# EAGLE design ADS1248Shield (EAGLE 7.5.0)
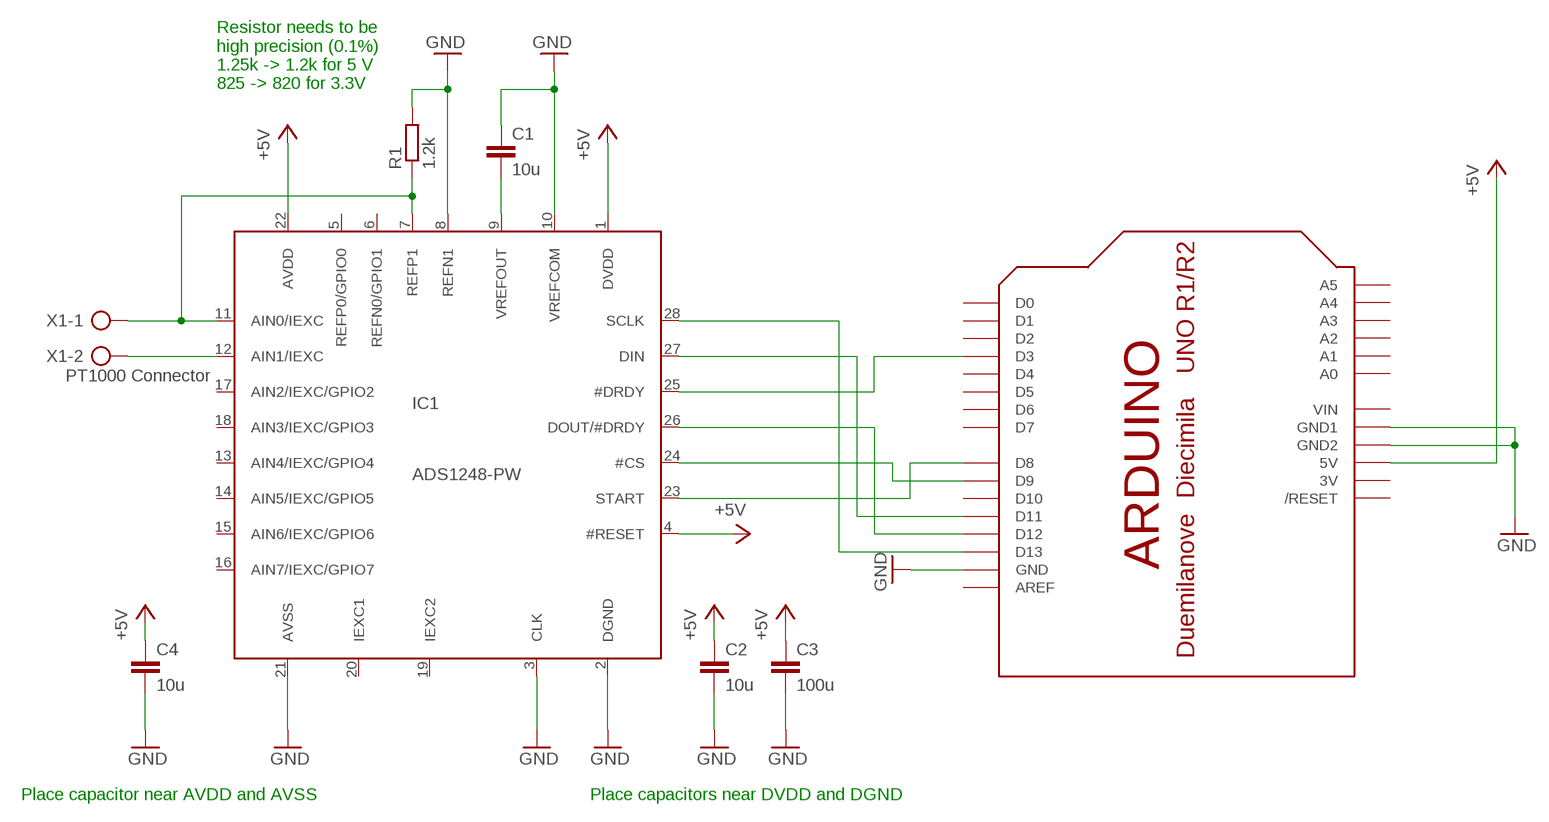
[diagram p0: schematic, sheet 1]

## Parts
C1  10u  C2.5/4  [C2.5-4]
C2  10u  C2.5/4  [C2.5-4]
C3  100u  C2.5/4  [C2.5-4]
C4  10u  C2.5/4  [C2.5-4]
IC1  ADS1248-PW  [TSSOP28]
R1  1.2k  R-EU_0204/2V  [0204V]
U$1  ARDUINOUNO  [ARDUINO]
X1  PT1000 Connector  AK300/2  [AK300/2]

## Nets
+5V: C2.1 C3.1 C4.1 IC1.1(DVDD) IC1.4(#RESET) IC1.22(AVDD) U$1.5V
GND: C1.1 C2.2 C3.2 C4.2 IC1.2(DGND) IC1.3(CLK) IC1.8(REFN1) IC1.10(VREFCOM) IC1.21(AVSS) R1.2 U$1.GND U$1.GND1 U$1.GND2
N$1: IC1.7(REFP1) IC1.11(AIN0/IEXC) R1.1 X1.1
N$2: IC1.28(SCLK) U$1.D13
N$3: IC1.12(AIN1/IEXC) X1.2
N$4: IC1.27(DIN) U$1.D11
N$5: IC1.25(#DRDY) U$1.D3
N$6: IC1.26(DOUT/#DRDY) U$1.D12
N$7: IC1.24(#CS) U$1.D9
N$8: IC1.23(START) U$1.D8
N$9: C1.2 IC1.9(VREFOUT)
Unconnected: IC1.5(REFP0/GPIO0) IC1.6(REFN0/GPIO1) IC1.13(AIN4/IEXC/GPIO4) IC1.14(AIN5/IEXC/GPIO5) IC1.15(AIN6/IEXC/GPIO6) IC1.16(AIN7/IEXC/GPIO7) IC1.17(AIN2/IEXC/GPIO2) IC1.18(AIN3/IEXC/GPIO3) IC1.19(IEXC2) IC1.20(IEXC1) U$1.A0 U$1.A1 U$1.A2 U$1.A3 U$1.A4 U$1.A5 U$1.AREF U$1.D0 U$1.D1 U$1.D2 U$1.D4 U$1.D5 U$1.D6 U$1.D7 U$1.D10 U$1.RESET(/RESET)

## Notes on the sheet
- Resistor needs to be
  high precision (0.1%)
  1.25k -> 1.2k for 5 V
  825 -> 820 for 3.3V
- Place capacitor near AVDD and AVSS | Place capacitors near DVDD and DGND

## Power pins joined to a net without a drawn wire
3V: U$1.3V
VIN: U$1.VIN

## Library data of the parts
C1-C4 = capacitor-wima:C: CAPACITOR naming: grid - package width
IC1 = ADS1248:ADS1248
R1 = resistor:R-EU_: RESISTOR, European symbol
U$1 = adafruit:ARDUINO: Arduino Diecimila/Duemilanove Make a shield with ease, this package has all the named pins as well as the two mounting drill holes and an outline of the USB and DC power connector. The outline is on the DIMENSION layer, so if your board house uses it they will cut the outline to match. http://www.ladyada.net/library/pcb/eaglelibrary.html
X1 = con-ptr500:AK300/2: CONNECTOR; OC_FARNELL: unknown; OC_NEWARK: unknown

## Board
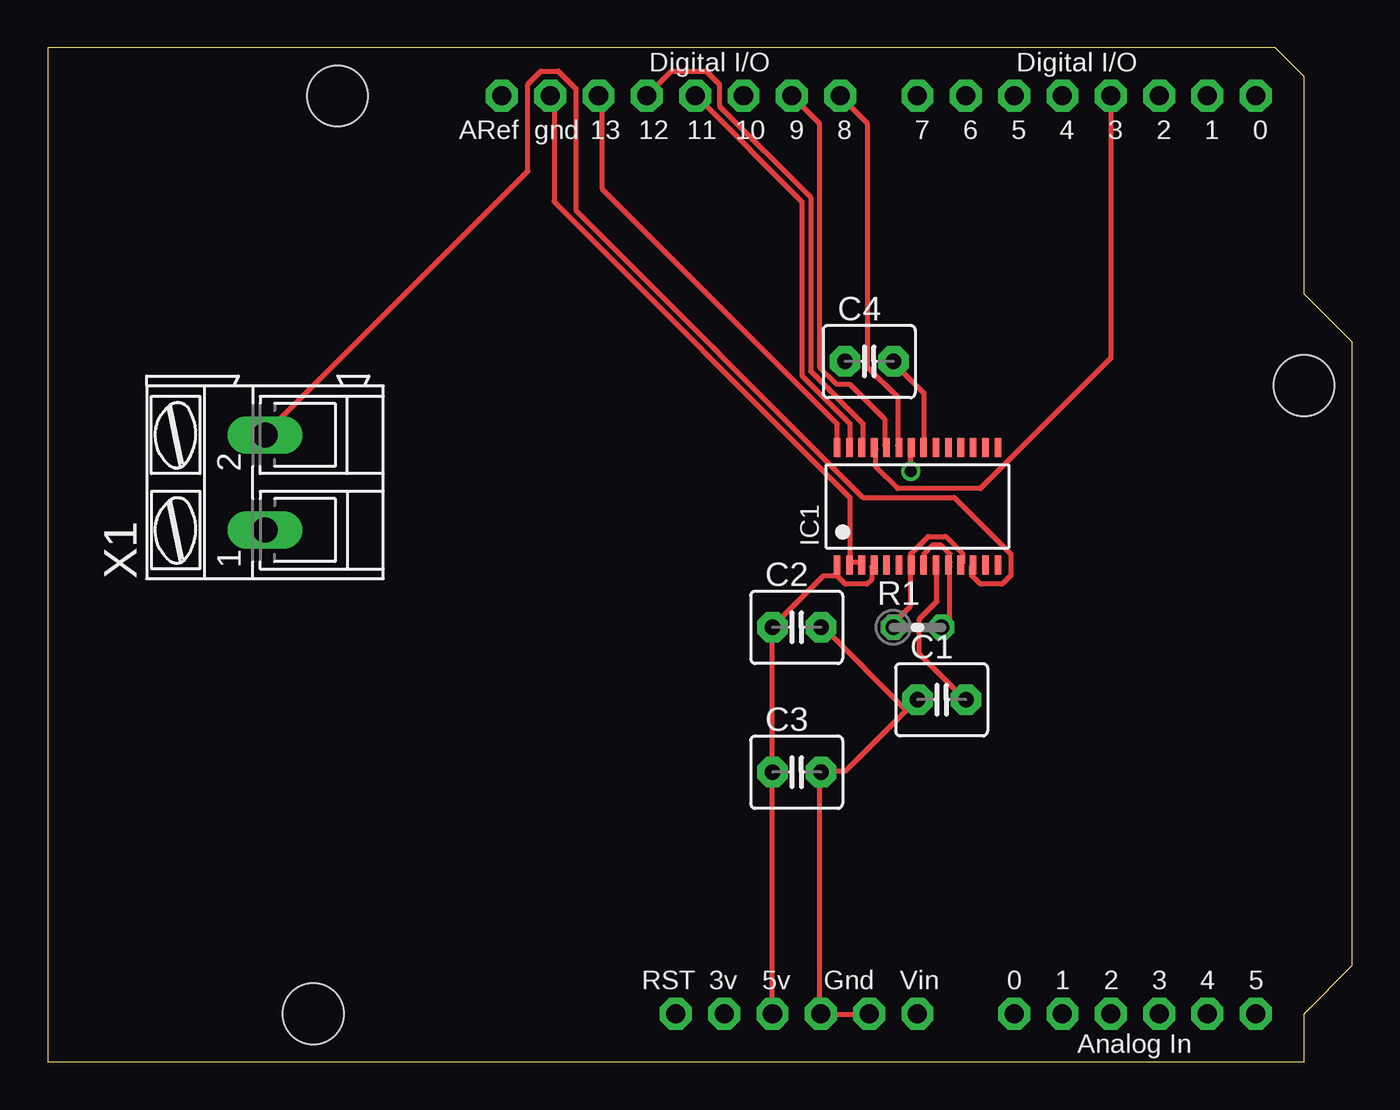
[diagram p1: board, top side]
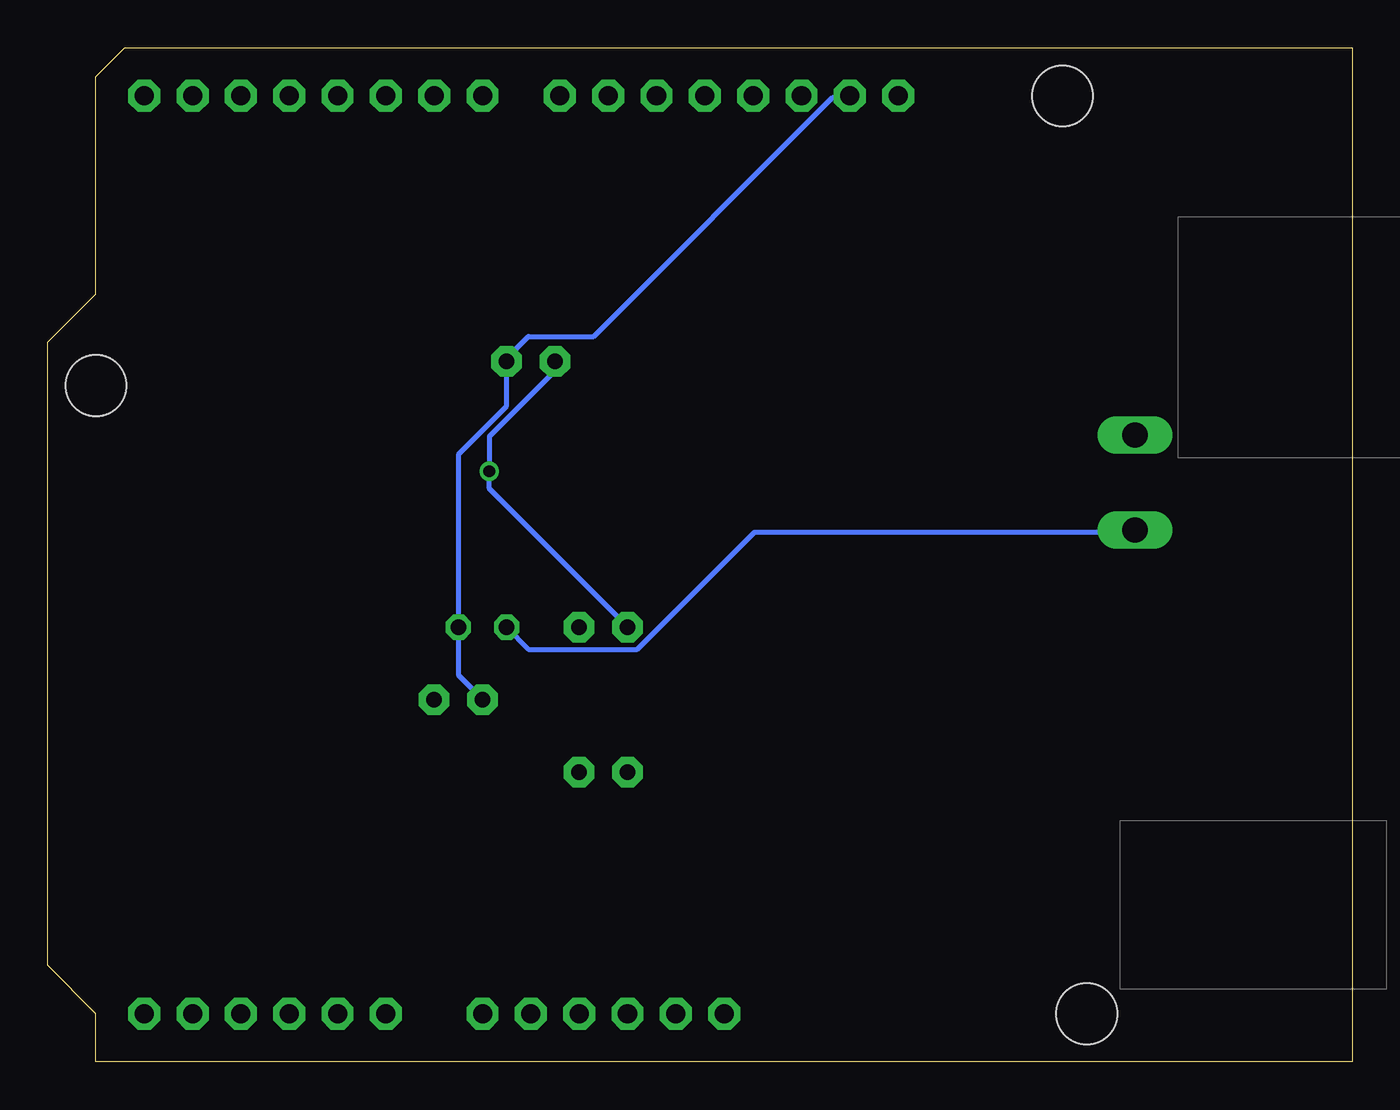
[diagram p2: board, bottom side, seen from below]

Size 68.58 x 53.34 mm. Coordinates in mm from the lower left corner, seen from the top.
Copper layers (1*16): Top 0.035mm / dielectric 1.5mm / Bottom 0.035mm
Design rules "default": minimum track width 10mil, minimum drill 24mil, track to track 8mil, track to pad 8mil, pad to pad 8mil, via to via 8mil, smd to smd 8mil, copper to edge 40mil, drill to drill 8mil, minimum pad ring 10mil, minimum via ring 8mil, stop-mask expansion 4mil, vias tented up to drill 0mil, thermal gap 10mil

### Footprints (pad centres in the part's own frame; a part is rotated, then mirrored left to right if it is on the bottom)
C2.5-4 = drill 0.813 pad 1.6 octagon: 1 -1.27,0; 2 1.27,0
TSSOP28 = smd 0.35 x 1: 1 -4.225,-3.087; 2 -3.575,-3.087; 3 -2.925,-3.087; 4 -2.275,-3.087; 5 -1.625,-3.087; 6 -0.975,-3.087; 7 -0.325,-3.087; 8 0.325,-3.087; 9 0.975,-3.087; 10 1.625,-3.087; 11 2.275,-3.087; 12 2.925,-3.087; 13 3.575,-3.087; 14 4.225,-3.087; 15 4.225,3.087; 16 3.575,3.087; 17 2.925,3.087; 18 2.275,3.087; 19 1.625,3.087; 20 0.975,3.087; 21 0.325,3.087; 22 -0.325,3.087; 23 -0.975,3.087; 24 -1.625,3.087; 25 -2.275,3.087; 26 -2.925,3.087; 27 -3.575,3.087; 28 -4.225,3.087
0204V = drill 0.813 octagon: 1 -1.27,0; 2 1.27,0
ARDUINO = drill 1 pad 1.676 octagon: 3V 35.56,2.54; 5V 38.1,2.54; A0 50.8,2.54; A1 53.34,2.54; A2 55.88,2.54; A3 58.42,2.54; A4 60.96,2.54; A5 63.5,2.54; AREF 23.876,50.8; D0 63.5,50.8; D1 60.96,50.8; D2 58.42,50.8; D3 55.88,50.8; D4 53.34,50.8; D5 50.8,50.8; D6 48.26,50.8; D7 45.72,50.8; D8 41.656,50.8; D9 39.116,50.8; D10 36.576,50.8; D11 34.036,50.8; D12 31.496,50.8; D13 28.956,50.8; GND 26.416,50.8; GND1 43.18,2.54; GND2 40.64,2.54; RESET 33.02,2.54; VIN 45.72,2.54 | hole 3.2: 15.24,50.8; 66.04,35.56; 13.97,2.54
AK300/2 = drill 1.321 long: 1 -2.515,0; 2 2.489,0

### Placement (x,y rotation side)
C1  46.99,19.05 0 top
C2  39.37,22.86 0 top
C3  39.37,15.24 0 top
C4  43.18,36.83 0 top
IC1  45.72,29.21 0 top
R1  45.72,22.86 0 top
U$1  0,0 0 top
X1  11.43,30.48 90 top

### Tracks (layer width: path | path; a pad name or v marks a point on that pad's centre or on a via)
+5V  (via drill 0.61)
  Top 0.254: v45.36,31.06 45.36,32.21 IC1.22 | 41.48,25.58 41.48,26.04 IC1.1 | 41.48,25.58 41.94,25.12 43.08,25.12 43.31,25.35 43.31,26.04 IC1.4 | 41.48,25.58 40.79,25.58 38.28,23.06 C2.1 38.05,22.84 38.05,15.29 C3.1 38.05,15.06 38.05,2.72 U$1.5V
  Bottom 0.254: C4.1 41.94,36.78 41.94,36.32 45.36,32.89 v45.36,31.06 45.36,30.15 38.28,23.06 C2.1
GND
  Top 0.254: 42.16,26.26 42.62,26.26 IC1.3 | 42.16,26.26 42.16,29.69 26.62,45.24 26.62,50.72 U$1.GND | 42.16,26.26 IC1.2 | U$1.GND1 43.08,2.49 40.79,2.49 U$1.GND2 40.56,2.72 40.56,15.06 C3.2 40.79,15.29 41.94,15.29 45.14,18.49 | IC1.21 46.05,32.44 46.05,35.18 44.45,36.78 C4.2 | IC1.8 46.05,26.26 46.05,26.72 46.51,27.18 46.97,27.18 47.42,26.72 47.42,26.26 IC1.10 47.42,26.04 47.42,23.29 R1.2 | 45.14,18.49 45.59,18.95 C1.1 | 45.14,18.49 40.79,22.84 C2.2
  Bottom 0.254: C1.1 45.82,19.18 46.97,20.32 46.97,22.84 R1.2 46.97,23.06 46.97,31.98 44.45,34.49 C4.2 44.45,37.01 43.31,38.15 39.88,38.15 27.31,50.72 26.62,50.72 U$1.GND
N$1
  Top 0.254: R1.1 44.45,23.06 45.36,23.98 45.36,26.04 IC1.7 45.36,26.26 45.36,26.72 46.28,27.63 47.19,27.63 48.11,26.72 48.11,26.26 IC1.11
  Bottom 0.254: X1.1 11.53,27.86 31.42,27.86 37.59,21.69 43.31,21.69 44.45,22.84 R1.1
N$2
  Top 0.254: IC1.28 41.48,32.44 41.48,33.58 29.13,45.92 29.13,50.72 U$1.D13
N$3
  Top 0.254: IC1.12 48.56,26.04 48.56,25.58 49.02,25.12 50.17,25.12 50.62,25.58 50.62,26.72 47.65,29.69 42.85,29.69 27.76,44.78 27.76,51.18 26.85,52.09 25.93,52.09 25.25,51.41 25.25,46.84 11.53,33.12 X1.2
N$4
  Top 0.254: IC1.27 42.16,32.44 42.16,33.58 39.65,36.09 39.65,45.24 34.16,50.72 U$1.D11
N$5
  Top 0.254: U$1.D3 55.88,37.01 49.02,30.15 44.68,30.15 43.54,31.29 43.54,32.21 IC1.25
N$6
  Top 0.254: U$1.D12 32.79,52.09 34.62,52.09 35.31,51.41 35.31,50.27 40.11,45.47 40.11,36.32 42.85,33.58 42.85,32.44 IC1.26
N$7
  Top 0.254: U$1.D9 40.56,49.35 40.56,36.55 41.48,35.64 42.16,35.64 43.99,33.81 43.99,32.44 IC1.24
N$8
  Top 0.254: IC1.23 44.68,32.44 44.68,34.95 43.08,36.55 43.08,49.35 41.71,50.72 U$1.D8
N$9
  Top 0.254: IC1.9 46.74,26.04 46.74,24.21 45.82,23.29 45.82,21.46 48.11,19.18 C1.2